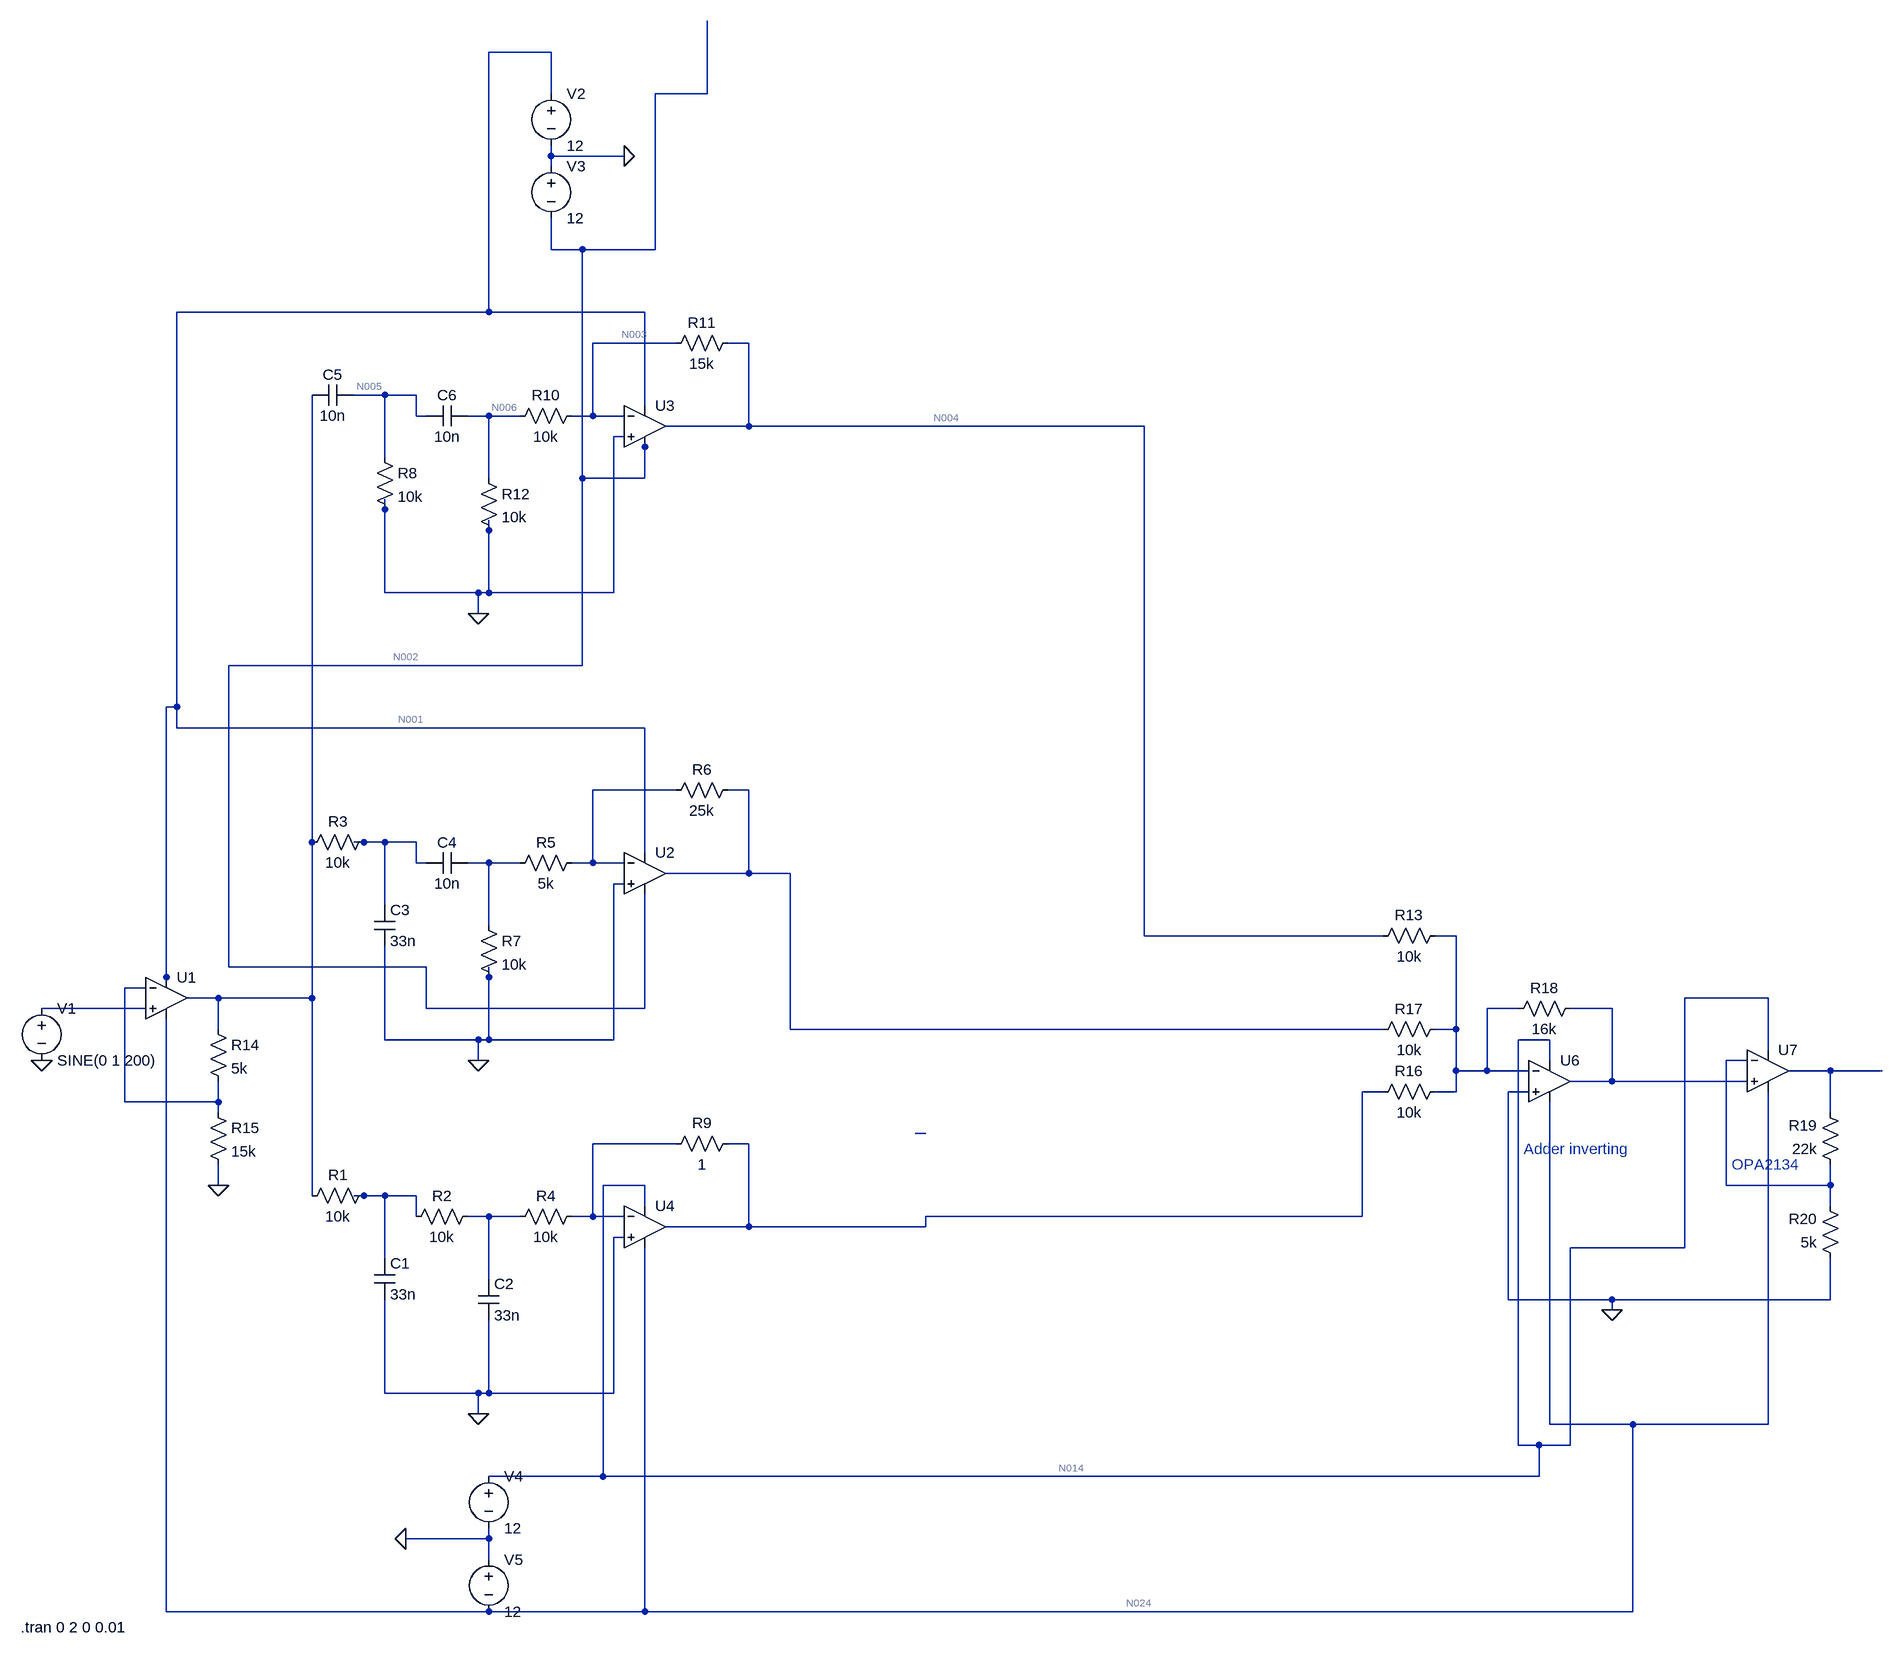
[diagram p0: schematic Draft11 LtAmp.asc]
Draft11 LtAmp.asc, the LTspice schematic file:
Version 4
SHEET 1 2164 968
WIRE 112 -1472 16 -1472
WIRE 112 -1408 112 -1472
WIRE 352 -1408 352 -1520
WIRE 352 -1408 272 -1408
WIRE 112 -1312 112 -1328
WIRE 224 -1312 112 -1312
WIRE 112 -1296 112 -1312
WIRE 112 -1168 112 -1216
WIRE 160 -1168 112 -1168
WIRE 272 -1168 272 -1408
WIRE 272 -1168 160 -1168
WIRE 16 -1072 16 -1472
WIRE 16 -1072 -464 -1072
WIRE 256 -1072 16 -1072
WIRE 304 -1024 176 -1024
WIRE 416 -1024 384 -1024
WIRE -144 -944 -192 -944
WIRE -96 -944 -144 -944
WIRE 256 -928 256 -1072
WIRE -96 -912 -96 -944
WIRE -80 -912 -96 -912
WIRE 16 -912 -16 -912
WIRE 64 -912 16 -912
WIRE 176 -912 176 -1024
WIRE 176 -912 144 -912
WIRE 224 -912 176 -912
WIRE 416 -896 416 -1024
WIRE 416 -896 288 -896
WIRE 1024 -896 416 -896
WIRE 224 -880 208 -880
WIRE 256 -864 256 -880
WIRE -144 -848 -144 -944
WIRE 16 -816 16 -912
WIRE 160 -816 160 -1168
WIRE 256 -816 256 -864
WIRE 256 -816 160 -816
WIRE -144 -768 -144 -784
WIRE 16 -736 16 -752
WIRE -144 -640 -144 -768
WIRE 0 -640 -144 -640
WIRE 16 -640 16 -736
WIRE 16 -640 0 -640
WIRE 208 -640 208 -880
WIRE 208 -640 16 -640
WIRE 0 -608 0 -640
WIRE 160 -528 160 -816
WIRE 160 -528 -384 -528
WIRE -464 -464 -464 -1072
WIRE -464 -464 -480 -464
WIRE -464 -432 -464 -464
WIRE 256 -432 -464 -432
WIRE 304 -336 176 -336
WIRE 416 -336 384 -336
WIRE -256 -256 -256 -944
WIRE -176 -256 -192 -256
WIRE -144 -256 -176 -256
WIRE -96 -256 -144 -256
WIRE 256 -240 256 -432
WIRE -96 -224 -96 -256
WIRE -80 -224 -96 -224
WIRE 16 -224 -16 -224
WIRE 64 -224 16 -224
WIRE 176 -224 176 -336
WIRE 176 -224 144 -224
WIRE 224 -224 176 -224
WIRE 416 -208 416 -336
WIRE 416 -208 288 -208
WIRE 480 -208 416 -208
WIRE 224 -192 208 -192
WIRE -144 -160 -144 -256
WIRE 16 -128 16 -224
WIRE 1024 -112 1024 -896
WIRE 1392 -112 1024 -112
WIRE 1504 -112 1472 -112
WIRE -384 -64 -384 -528
WIRE -80 -64 -384 -64
WIRE -480 -48 -480 -464
WIRE 16 -48 16 -64
WIRE -512 -32 -544 -32
WIRE -480 -32 -480 -48
WIRE -400 -16 -448 -16
WIRE -256 -16 -256 -256
WIRE -256 -16 -400 -16
WIRE 1984 -16 1856 -16
WIRE -512 0 -672 0
WIRE -80 0 -80 -64
WIRE 256 0 256 -176
WIRE 256 0 -80 0
WIRE 1600 0 1552 0
WIRE 1744 0 1680 0
WIRE -400 32 -400 -16
WIRE 480 32 480 -208
WIRE 1392 32 480 32
WIRE 1504 32 1504 -112
WIRE 1504 32 1472 32
WIRE -144 48 -144 -96
WIRE 0 48 -144 48
WIRE 16 48 16 -48
WIRE 16 48 0 48
WIRE 208 48 208 -192
WIRE 208 48 16 48
WIRE 1648 48 1600 48
WIRE 1984 64 1984 -16
WIRE 0 80 0 48
WIRE 1648 80 1648 48
WIRE 1952 80 1920 80
WIRE 1504 96 1504 32
WIRE 1552 96 1552 0
WIRE 1552 96 1504 96
WIRE 1616 96 1552 96
WIRE 2080 96 2016 96
WIRE 2160 96 2080 96
WIRE 1744 112 1744 0
WIRE 1744 112 1680 112
WIRE 1952 112 1744 112
WIRE 1392 128 1360 128
WIRE 1504 128 1504 96
WIRE 1504 128 1472 128
WIRE 1616 128 1584 128
WIRE -544 144 -544 -32
WIRE -400 144 -400 112
WIRE -400 144 -544 144
WIRE -400 160 -400 144
WIRE 2080 160 2080 96
WIRE 688 192 672 192
WIRE 304 208 176 208
WIRE 416 208 384 208
WIRE -400 272 -400 240
WIRE 256 272 192 272
WIRE 1920 272 1920 80
WIRE 2080 272 2080 240
WIRE 2080 272 1920 272
WIRE -256 288 -256 -16
WIRE -176 288 -192 288
WIRE -144 288 -176 288
WIRE -96 288 -144 288
WIRE 256 304 256 272
WIRE 2080 304 2080 272
WIRE -96 320 -96 288
WIRE 16 320 -16 320
WIRE 64 320 16 320
WIRE 176 320 176 208
WIRE 176 320 144 320
WIRE 224 320 176 320
WIRE 1360 320 1360 128
WIRE 1360 320 688 320
WIRE 416 336 416 208
WIRE 416 336 288 336
WIRE 688 336 688 320
WIRE 688 336 416 336
WIRE 224 352 208 352
WIRE 1856 368 1856 -16
WIRE 1856 368 1680 368
WIRE -144 384 -144 288
WIRE 16 416 16 320
WIRE 1584 448 1584 128
WIRE 1744 448 1584 448
WIRE 2080 448 2080 384
WIRE 2080 448 1744 448
WIRE 1744 464 1744 448
WIRE -144 592 -144 448
WIRE 0 592 -144 592
WIRE 16 592 16 480
WIRE 16 592 0 592
WIRE 208 592 208 352
WIRE 208 592 16 592
WIRE 0 624 0 592
WIRE 1648 640 1648 144
WIRE 1776 640 1648 640
WIRE 1984 640 1984 128
WIRE 1984 640 1776 640
WIRE 1600 672 1600 48
WIRE 1632 672 1600 672
WIRE 1680 672 1680 368
WIRE 1680 672 1632 672
WIRE 192 720 192 272
WIRE 192 720 16 720
WIRE 1632 720 1632 672
WIRE 1632 720 192 720
WIRE 16 816 16 800
WIRE 16 816 -112 816
WIRE 16 848 16 816
WIRE -480 928 -480 16
WIRE 16 928 -480 928
WIRE 256 928 256 368
WIRE 256 928 16 928
WIRE 1776 928 1776 640
WIRE 1776 928 256 928
FLAG 0 624 0
FLAG -672 80 0
FLAG 224 -1312 0
FLAG -112 816 0
FLAG 1744 464 0
FLAG -400 272 0
FLAG 0 80 0
FLAG 0 -608 0
SYMBOL Opamps\\UniversalOpamp2 -480 -16 R0
SYMATTR InstName U1
SYMBOL res -160 272 R90
WINDOW 0 0 56 VBottom 2
WINDOW 3 32 56 VTop 2
SYMATTR InstName R1
SYMATTR Value 10k
SYMBOL res -416 16 R0
SYMATTR InstName R14
SYMATTR Value 5k
SYMBOL res -416 144 R0
SYMATTR InstName R15
SYMATTR Value 15k
SYMBOL voltage -672 -16 R0
WINDOW 123 0 0 Left 2
WINDOW 39 0 0 Left 2
SYMATTR InstName V1
SYMATTR Value SINE(0 1 200)
SYMBOL voltage 112 -1424 R0
WINDOW 123 0 0 Left 2
WINDOW 39 0 0 Left 2
SYMATTR InstName V2
SYMATTR Value 12
SYMBOL voltage 112 -1312 R0
WINDOW 123 0 0 Left 2
WINDOW 39 0 0 Left 2
SYMATTR InstName V3
SYMATTR Value 12
SYMBOL voltage 16 704 R0
WINDOW 123 0 0 Left 2
WINDOW 39 0 0 Left 2
SYMATTR InstName V4
SYMATTR Value 12
SYMBOL voltage 16 832 R0
WINDOW 123 0 0 Left 2
WINDOW 39 0 0 Left 2
SYMATTR InstName V5
SYMATTR Value 12
SYMBOL Opamps\\UniversalOpamp2 1648 112 R0
SYMATTR InstName U6
SYMBOL res 1488 112 R90
WINDOW 0 0 56 VBottom 2
WINDOW 3 32 56 VTop 2
SYMATTR InstName R16
SYMATTR Value 10k
SYMBOL res 1488 16 R90
WINDOW 0 0 56 VBottom 2
WINDOW 3 32 56 VTop 2
SYMATTR InstName R17
SYMATTR Value 10k
SYMBOL res 1584 16 R270
WINDOW 0 32 56 VTop 2
WINDOW 3 0 56 VBottom 2
SYMATTR InstName R18
SYMATTR Value 16k
SYMBOL Opamps\\UniversalOpamp2 1984 96 R0
SYMATTR InstName U7
SYMBOL res 2096 256 R180
WINDOW 0 36 76 Left 2
WINDOW 3 36 40 Left 2
SYMATTR InstName R19
SYMATTR Value 22k
SYMBOL res 2096 400 R180
WINDOW 0 36 76 Left 2
WINDOW 3 36 40 Left 2
SYMATTR InstName R20
SYMATTR Value 5k
SYMBOL cap -160 384 R0
SYMATTR InstName C1
SYMATTR Value 33n
SYMBOL Opamps\\UniversalOpamp2 256 336 R0
SYMATTR InstName U4
SYMBOL res 160 304 R90
WINDOW 0 0 56 VBottom 2
WINDOW 3 32 56 VTop 2
SYMATTR InstName R4
SYMATTR Value 10k
SYMBOL res 400 192 R90
WINDOW 0 0 56 VBottom 2
WINDOW 3 32 56 VTop 2
SYMATTR InstName R9
SYMATTR Value 1
SYMBOL res 0 304 R90
WINDOW 0 0 56 VBottom 2
WINDOW 3 32 56 VTop 2
SYMATTR InstName R2
SYMATTR Value 10k
SYMBOL cap 0 416 R0
SYMATTR InstName C2
SYMATTR Value 33n
SYMBOL res -160 -272 R90
WINDOW 0 0 56 VBottom 2
WINDOW 3 32 56 VTop 2
SYMATTR InstName R3
SYMATTR Value 10k
SYMBOL cap -160 -160 R0
SYMATTR InstName C3
SYMATTR Value 33n
SYMBOL Opamps\\UniversalOpamp2 256 -208 R0
SYMATTR InstName U2
SYMBOL res 160 -240 R90
WINDOW 0 0 56 VBottom 2
WINDOW 3 32 56 VTop 2
SYMATTR InstName R5
SYMATTR Value 5k
SYMBOL res 400 -352 R90
WINDOW 0 0 56 VBottom 2
WINDOW 3 32 56 VTop 2
SYMATTR InstName R6
SYMATTR Value 25k
SYMBOL cap -16 -240 R90
WINDOW 0 0 32 VBottom 2
WINDOW 3 32 32 VTop 2
SYMATTR InstName C4
SYMATTR Value 10n
SYMBOL res 0 -144 R0
SYMATTR InstName R7
SYMATTR Value 10k
SYMBOL Opamps\\UniversalOpamp2 256 -896 R0
SYMATTR InstName U3
SYMBOL res 160 -928 R90
WINDOW 0 0 56 VBottom 2
WINDOW 3 32 56 VTop 2
SYMATTR InstName R10
SYMATTR Value 10k
SYMBOL res 400 -1040 R90
WINDOW 0 0 56 VBottom 2
WINDOW 3 32 56 VTop 2
SYMATTR InstName R11
SYMATTR Value 15k
SYMBOL cap -16 -928 R90
WINDOW 0 0 32 VBottom 2
WINDOW 3 32 32 VTop 2
SYMATTR InstName C6
SYMATTR Value 10n
SYMBOL res 0 -832 R0
SYMATTR InstName R12
SYMATTR Value 10k
SYMBOL res -160 -864 R0
SYMATTR InstName R8
SYMATTR Value 10k
SYMBOL cap -192 -960 R90
WINDOW 0 0 32 VBottom 2
WINDOW 3 32 32 VTop 2
SYMATTR InstName C5
SYMATTR Value 10n
SYMBOL res 1488 -128 R90
WINDOW 0 0 56 VBottom 2
WINDOW 3 32 56 VTop 2
SYMATTR InstName R13
SYMATTR Value 10k
TEXT -704 952 Left 2 !.tran 0 2 0 0.01
TEXT 1928 240 Left 2 ;OPA2134
TEXT 1608 216 Left 2 ;Adder inverting

The netlist it stands for:
* Draft11 LtAmp.asc
XU1 N015 N013 N001 N024 N009 level.2 Avol=1Meg GBW=10Meg Slew=10Meg ilimit=25m rail=0 Vos=0 phimargin=45 en=0 enk=0 in=0 ink=0 Rin=500Meg  ; pins IN+ IN- V+ V- OUT
R1 N022 N009 10k
R14 N009 N013 5k
R15 N013 0 15k
V1 N015 0 SINE(0 1 200)
V2 N001 0 12
V3 0 N002 12
V4 N014 0 12
V5 0 N024 12
XU6 0 N012 N014 N024 N016 level.2 Avol=1Meg GBW=10Meg Slew=10Meg ilimit=25m rail=0 Vos=0 phimargin=45 en=0 enk=0 in=0 ink=0 Rin=500Meg  ; pins IN+ IN- V+ V- OUT
R16 N012 N019 10k
R17 N012 N008 10k
R18 N012 N016 16k
XU7 N016 N017 N014 N024 N018 level.2 Avol=1Meg GBW=10Meg Slew=10Meg ilimit=25m rail=0 Vos=0 phimargin=45 en=0 enk=0 in=0 ink=0 Rin=500Meg  ; pins IN+ IN- V+ V- OUT
R19 N017 N018 22k
R20 0 N017 5k
C1 N022 0 33n
XU4 0 N021 N014 N024 N019 level.2 Avol=1Meg GBW=10Meg Slew=10Meg ilimit=25m rail=0 Vos=0 phimargin=45 en=0 enk=0 in=0 ink=0 Rin=500Meg  ; pins IN+ IN- V+ V- OUT
R4 N021 N023 10k
R9 N019 N021 1
R2 N023 N022 10k
C2 N023 0 33n
R3 N010 N009 10k
C3 N010 0 33n
XU2 0 N007 N001 N002 N008 level.2 Avol=1Meg GBW=10Meg Slew=10Meg ilimit=25m rail=0 Vos=0 phimargin=45 en=0 enk=0 in=0 ink=0 Rin=500Meg  ; pins IN+ IN- V+ V- OUT
R5 N007 N011 5k
R6 N008 N007 25k
C4 N011 N010 10n
R7 N011 0 10k
XU3 0 N003 N001 N002 N004 level.2 Avol=1Meg GBW=10Meg Slew=10Meg ilimit=25m rail=0 Vos=0 phimargin=45 en=0 enk=0 in=0 ink=0 Rin=500Meg  ; pins IN+ IN- V+ V- OUT
R10 N003 N006 10k
R11 N004 N003 15k
C6 N006 N005 10n
R12 N006 0 10k
R8 N005 0 10k
C5 N005 N009 10n
R13 N012 N004 10k
.tran 0 2 0 0.01
* OPA2134
* Adder inverting
.lib UniversalOpamps2.sub
.backanno
.end

* Results of the author's LTspice run, read from the files saved beside the schematic
* Operating Point, zero values left out:
*   V(n001) = 12 V
*   V(n024) = -12 V
*   V(n002) = -12 V
*   V(n014) = 12 V
*   I(V5) = -4.797 mA
*   I(V4) = -3.597 mA
*   I(V3) = -2.398 mA
*   I(V2) = -3.597 mA
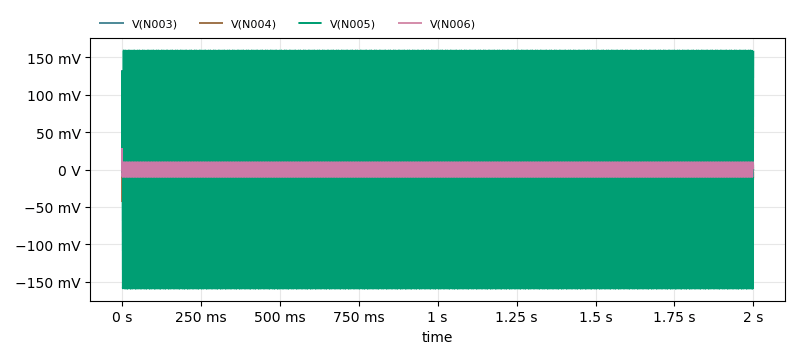
[diagram p1: Transient Analysis of Draft11 LtAmp.asc, plotted from the saved traces]
* Transient Analysis, 1 run:
*   V(N003): min -2.342 µV, max 39.62 µV, average 20.44 pV, rms 234.8 nV, last -484.4 nV
*   V(N004): min -42.43 mV, max 15.09 mV, average -5.981 µV, rms 10.73 mV, last -4.084 mV
*   V(N005): min -159.4 mV, max 159.4 mV, average -15.03 µV, rms 112.1 mV, last 157.8 mV
*   V(N006): min -10.06 mV, max 28.29 mV, average 3.987 µV, rms 7.151 mV, last 2.722 mV